# Altium project USBAudioAmp.PrjPCB
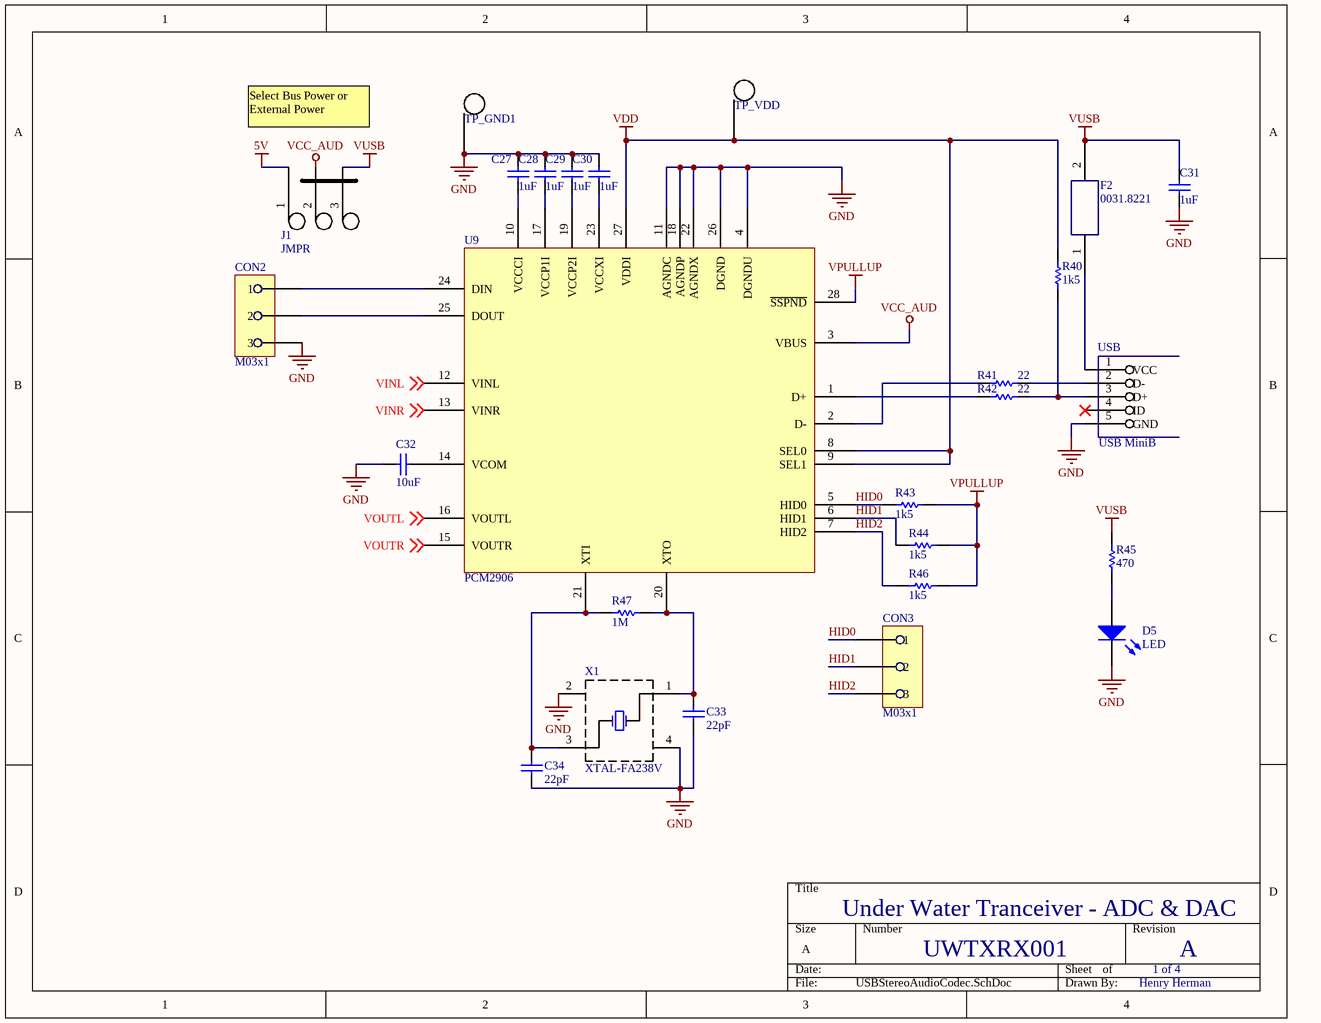
[diagram p0: USBStereoAudioCodec.SchDoc]
4 sheets, 125 parts. Net scope: global (net labels, ports and power ports of the same name join across sheets).
Board file: USBAudioAmp.PcbDoc
Sheets:
  USBStereoAudioCodec.SchDoc
  AmplifierOutput.SchDoc
  AmplifierInput.SchDoc
  PWRSUPPLY.SchDoc

## Sheet USBStereoAudioCodec.SchDoc
size A

### Parts
C27  value 1uF  [SM/C_0805]  (hidden comment: CAP)
C28  value 1uF  [SM/C_0805]  (hidden comment: CAP)
C29  value 1uF  [SM/C_0805]  (hidden comment: CAP)
C30  value 1uF  [SM/C_0805]  (hidden comment: CAP)
C31  value 1uF  [SM/C_0805]  (hidden comment: CAP)
C32  value 10uF  [SM/C_0805]  (hidden comment: CAP)
C33  value 22pF  [SM/C_0805]  (hidden comment: CAP)
C34  value 22pF  [SM/C_0805]  (hidden comment: CAP)
CON2  M03x1  [M03x1]
CON3  M03x1  [M03x1]
D5  LED  [LED-0805]
F2  0031.8221  [SM/R_0805]
J1  JMPR  [M03x1-nolock]
R40  value 1k5  [SM/R_0805]  (hidden comment: Res)
R41  value 22  [SM/R_0805]  (hidden comment: Res)
R42  value 22  [SM/R_0805]  (hidden comment: Res)
R43  value 1k5  [SM/R_0805]  (hidden comment: Res)
R44  value 1k5  [SM/R_0805]  (hidden comment: Res)
R45  value 470  [SM/R_0805]  (hidden comment: Res)
R46  value 1k5  [SM/R_0805]  (hidden comment: Res)
R47  value 1M  [SM/R_0805]  (hidden comment: Res)
TP_GND1  TEST_PT  [TEST_PT_SMD]  (value not drawn)
TP_VDD  TEST_PT  [TEST_PT_SMD]  (value not drawn)
U9  PCM2906  [SSOP-28PIN-TI]
USB  USB MiniB  [USB-MINIB]
X1  XTAL-FA238V  [XTAL 12MHz SMD]

### Nets
5V: J1.1(P1)
GND: C27.1 C28.1 C29.1 C30.1 C31.2 C32.2 C33.1 C34.1 CON2.3 D5.2(K) TP_GND1.1(TP?) U9.4(DGNDU) U9.11(AGNDC) U9.18(AGNDP) U9.22(AGNDX) U9.26(DGND) USB.5(GND) X1.2 X1.4
VCC_AUD: J1.2(P2) U9.3(VBUS)
VDD: R40.1 TP_VDD.1(TP?) U9.8(SEL0) U9.9(SEL1) U9.27(VDDI)
VPULLUP: R43.2 R44.2 R46.2 U9.28(~{SSPND})
VUSB: C31.1 F2.2 J1.3 R45.1
HID0: CON3.1 R43.1 U9.5(HID0)
HID1: CON3.2 R44.1 U9.6(HID1)
HID2: CON3.3 R46.1 U9.7(HID2)
VINL: U9.12(VINL) ; off-sheet VINL
VINR: U9.13(VINR) ; off-sheet VINR
VOUTL: U9.16(VOUTL) ; off-sheet VOUTL
VOUTR: U9.15(VOUTR) ; off-sheet VOUTR
NetC27_2: C27.2 U9.10(VCCCI)
NetC28_2: C28.2 U9.17(VCCP1I)
NetC29_2: C29.2 U9.19(VCCP2I)
NetC30_2: C30.2 U9.23(VCCXI)
NetC32_1: C32.1 U9.14(VCOM)
NetC33_2: C33.2 R47.1 U9.20(XTO) X1.1
NetC34_2: C34.2 R47.2 U9.21(XTI) X1.3
NetCON2_1: CON2.1 U9.24(DIN)
NetCON2_2: CON2.2 U9.25(DOUT)
NetD5_1: D5.1(A) R45.2
NetF2_1: F2.1 USB.1(VCC)
NetR40_2: R40.2 R42.2 USB.3(D+)
NetR41_1: R41.1 U9.2(D-)
NetR41_2: R41.2 USB.2(D-)
NetR42_1: R42.1 U9.1(D+)

Not connected (* = marked no-connect by the designer): USB 4(ID)*

### Notes on the sheet
- Select Bus Power or External Power
- Under Water Tranceiver - ADC & DAC
- UWTXRX001
- 1 of 4
- A
- Henry Herman

### Library data of the parts
F2 = Ferrite Bead: Published: 8-Jun-2000; LatestRevisionDate: 17-Jan-2003; LatestRevisionNote: PCB Footprint 'BCY-W3/D4.7' replaced; DatasheetDocument: 1997; PackageDocument: Sep-1998; PackageReference: TO-92A; Publisher: Altium Limited; ComponentLink1Description: Manufacturer Link; ComponentLink1URL: http://www.fairchildsemi.com/; ComponentLink2Description: Datasheet; ComponentLink2URL: http://www.fairchildsemi.com/ds/2N%2F2N3904.pdf
J1 = JMPR-3: Jumper; Published: 8-Jun-2000; LatestRevisionDate: 17-Jan-2003; LatestRevisionNote: PCB Footprint 'BCY-W3/D4.7' replaced; DatasheetDocument: 1997; PackageDocument: Sep-1998; PackageReference: TO-92A; Publisher: Altium Limited; ComponentLink1Description: Manufacturer Link; ComponentLink1URL: http://www.fairchildsemi.com/; ComponentLink2Description: Datasheet; ComponentLink2URL: http://www.fairchildsemi.com/ds/2N%2F2N3904.pdf
R40-R47 = Res: Resistor; Published: 8-Jun-2000; LatestRevisionDate: 17-Jul-2002; LatestRevisionNote: Re-released for DXP Platform.; PackageReference: AXIAL-0.3; Publisher: Altium Limited
U9 = PCM2906C
USB = USB MiniB: NPN General Purpose Amplifier; Published: 8-Jun-2000; LatestRevisionDate: 17-Jan-2003; LatestRevisionNote: PCB Footprint 'BCY-W3/D4.7' replaced; DatasheetDocument: 1997; PackageDocument: Sep-1998; PackageReference: TO-92A; Publisher: Altium Limited; ComponentLink1Description: Manufacturer Link; ComponentLink1URL: http://www.fairchildsemi.com/; ComponentLink2Description: Datasheet; ComponentLink2URL: http://www.fairchildsemi.com/ds/2N%2F2N3904.pdf
C27-C34 = CAP
  C27-C31: Label: 1uF
  C32: Label: 10uF

## Sheet AmplifierOutput.SchDoc
size A
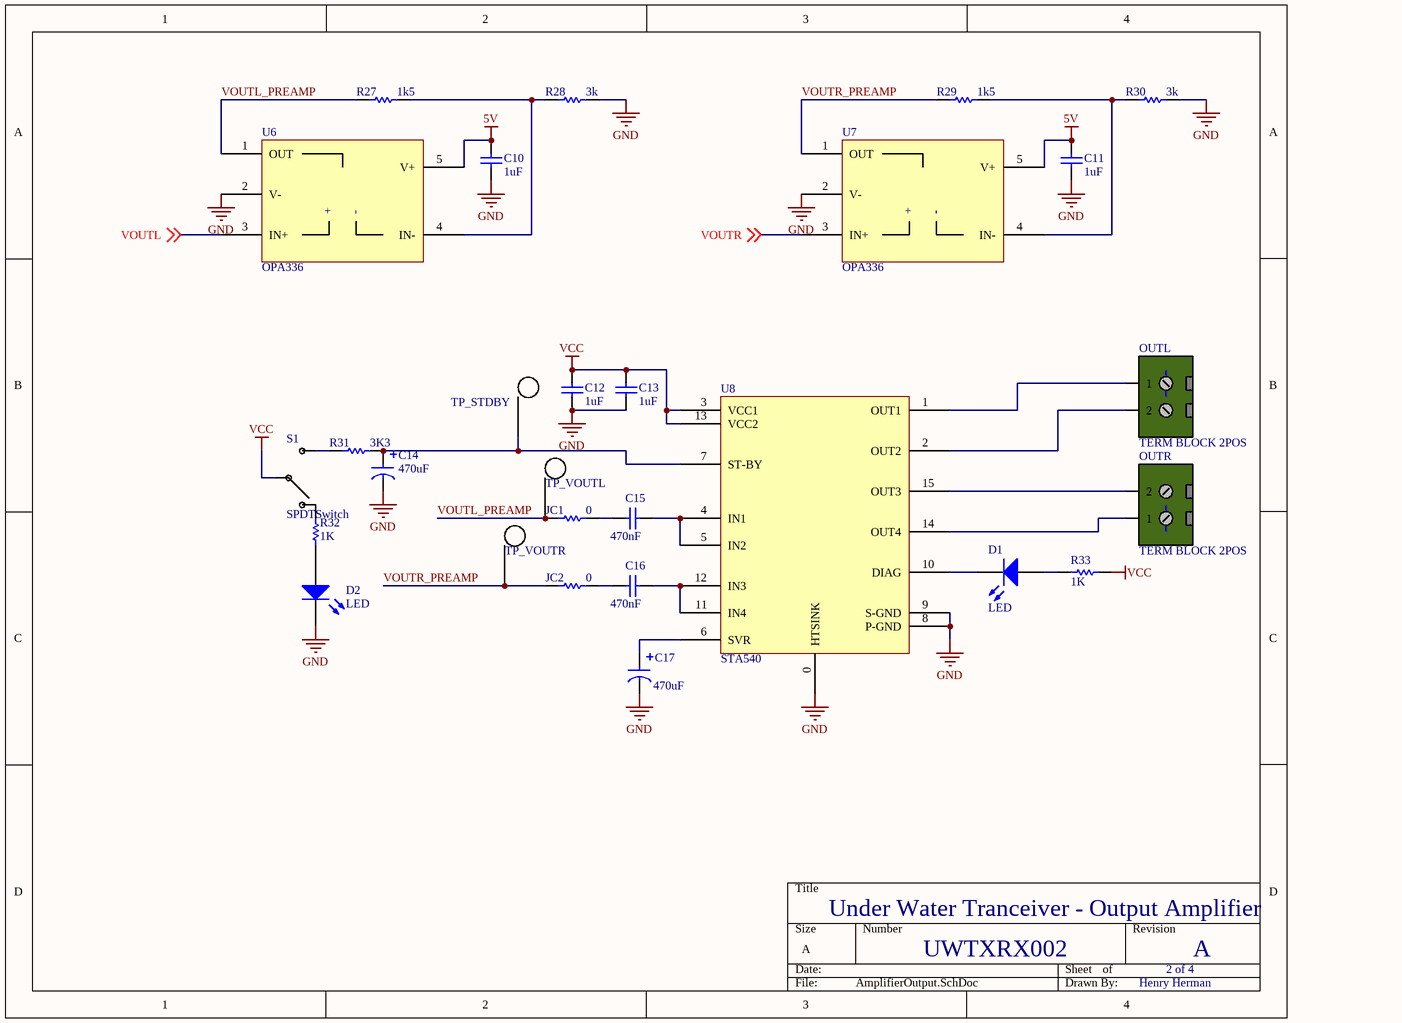
[diagram p1: AmplifierOutput.SchDoc]

### Parts
C10  value 1uF  [SM/C_0805]  (hidden comment: CAP)
C11  value 1uF  [SM/C_0805]  (hidden comment: CAP)
C12  value 1uF  [SM/C_0805]  (hidden comment: CAP)
C13  value 1uF  [SM/C_0805]  (hidden comment: CAP)
C14  value 470uF  [SM/CT_6032_12]  (hidden comment: CAP_POL)
C15  value 470nF  [SM/C_0805]  (hidden comment: CAP)
C16  value 470nF  [SM/C_0805]  (hidden comment: CAP)
C17  value 470uF  [SM/CT_6032_12]  (hidden comment: CAP_POL)
D1  LED  [LED-0805]
D2  LED  [LED-0805]
JC1  value 0  [SM/R_0805]  (hidden comment: Res)
JC2  value 0  [SM/R_0805]  (hidden comment: Res)
OUTL  TERM BLOCK 2POS  [Conn-ScrewTerminal-2pin-Phoenix]
OUTR  TERM BLOCK 2POS  [Conn-ScrewTerminal-2pin-Phoenix]
R27  value 1k5  [SM/R_0805]  (hidden comment: Res)
R28  value 3k  [SM/R_0805]  (hidden comment: Res)
R29  value 1k5  [SM/R_0805]  (hidden comment: Res)
R30  value 3k  [SM/R_0805]  (hidden comment: Res)
R31  value 3K3  [SM/R_0805]  (hidden comment: Res)
R32  value 1K  [SM/R_0805]  (hidden comment: Res)
R33  value 1K  [SM/R_0805]  (hidden comment: Res)
S1  SPDTSwitch  [SPDTSwitch]
TP_STDBY  TEST_PT  [TEST_PT_SMD]  (value not drawn)
TP_VOUTL  TEST_PT  [TEST_PT_SMD]  (value not drawn)
TP_VOUTR  TEST_PT  [TEST_PT_SMD]  (value not drawn)
U6  OPA336  [SOT23-5 -TI]
U7  OPA336  [SOT23-5 -TI]
U8  STA540  [STA540_Multiwatt15]

### Nets
5V: C10.1 C11.1 U6.5(V+) U7.5(V+)
GND: C10.2 C11.2 C12.1 C13.1 C14.2 C17.2 D2.2(K) R28.2 R30.2 U6.2(V-) U7.2(V-) U8.0(HTSINK) U8.8(P-GND) U8.9(S-GND)
VCC: C12.2 C13.2 R33.1 S1.2(C) U8.3(VCC1) U8.13(VCC2)
VOUTL: U6.3(IN+) ; off-sheet VOUTL
VOUTL_PREAMP: JC1.1 R27.1 TP_VOUTL.1(TP?) U6.1(OUT)
VOUTR: U7.3(IN+) ; off-sheet VOUTR
VOUTR_PREAMP: JC2.1 R29.1 TP_VOUTR.1(TP?) U7.1(OUT)
NetC14_1: C14.1 R31.2 TP_STDBY.1(TP?) U8.7(ST-BY)
NetC15_1: C15.1 JC1.2
NetC15_2: C15.2 U8.4(IN1) U8.5(IN2)
NetC16_1: C16.1 JC2.2
NetC16_2: C16.2 U8.11(IN4) U8.12(IN3)
NetC17_1: C17.1 U8.6(SVR)
NetD1_1: D1.1(A) R33.2
NetD1_2: D1.2(K) U8.10(DIAG)
NetD2_1: D2.1(A) R32.2
NetOUTL_1: OUTL.1 U8.1(OUT1)
NetOUTL_2: OUTL.2 U8.2(OUT2)
NetOUTR_1: OUTR.1 U8.14(OUT4)
NetOUTR_2: OUTR.2 U8.15(OUT3)
NetR27_2: R27.2 R28.1 U6.4(IN-)
NetR29_2: R29.2 R30.1 U7.4(IN-)
NetR31_1: R31.1 S1.3(P2)
NetR32_1: R32.1 S1.1(P1)

### Notes on the sheet
- Under Water Tranceiver - Output Amplifier
- UWTXRX002
- 2 of 4
- A
- Henry Herman
- (in symbol OPA335) +; -

### Library data of the parts
C14 C17 = CAP_POL: CAP
JC1 JC2 R27-R33 = Res: Resistor; Published: 8-Jun-2000; LatestRevisionDate: 17-Jul-2002; LatestRevisionNote: Re-released for DXP Platform.; PackageReference: AXIAL-0.3; Publisher: Altium Limited
OUTL OUTR = 2Pin-PhoenixTerminalBlock
U6 U7 = OPA335

## Sheet AmplifierInput.SchDoc
size B
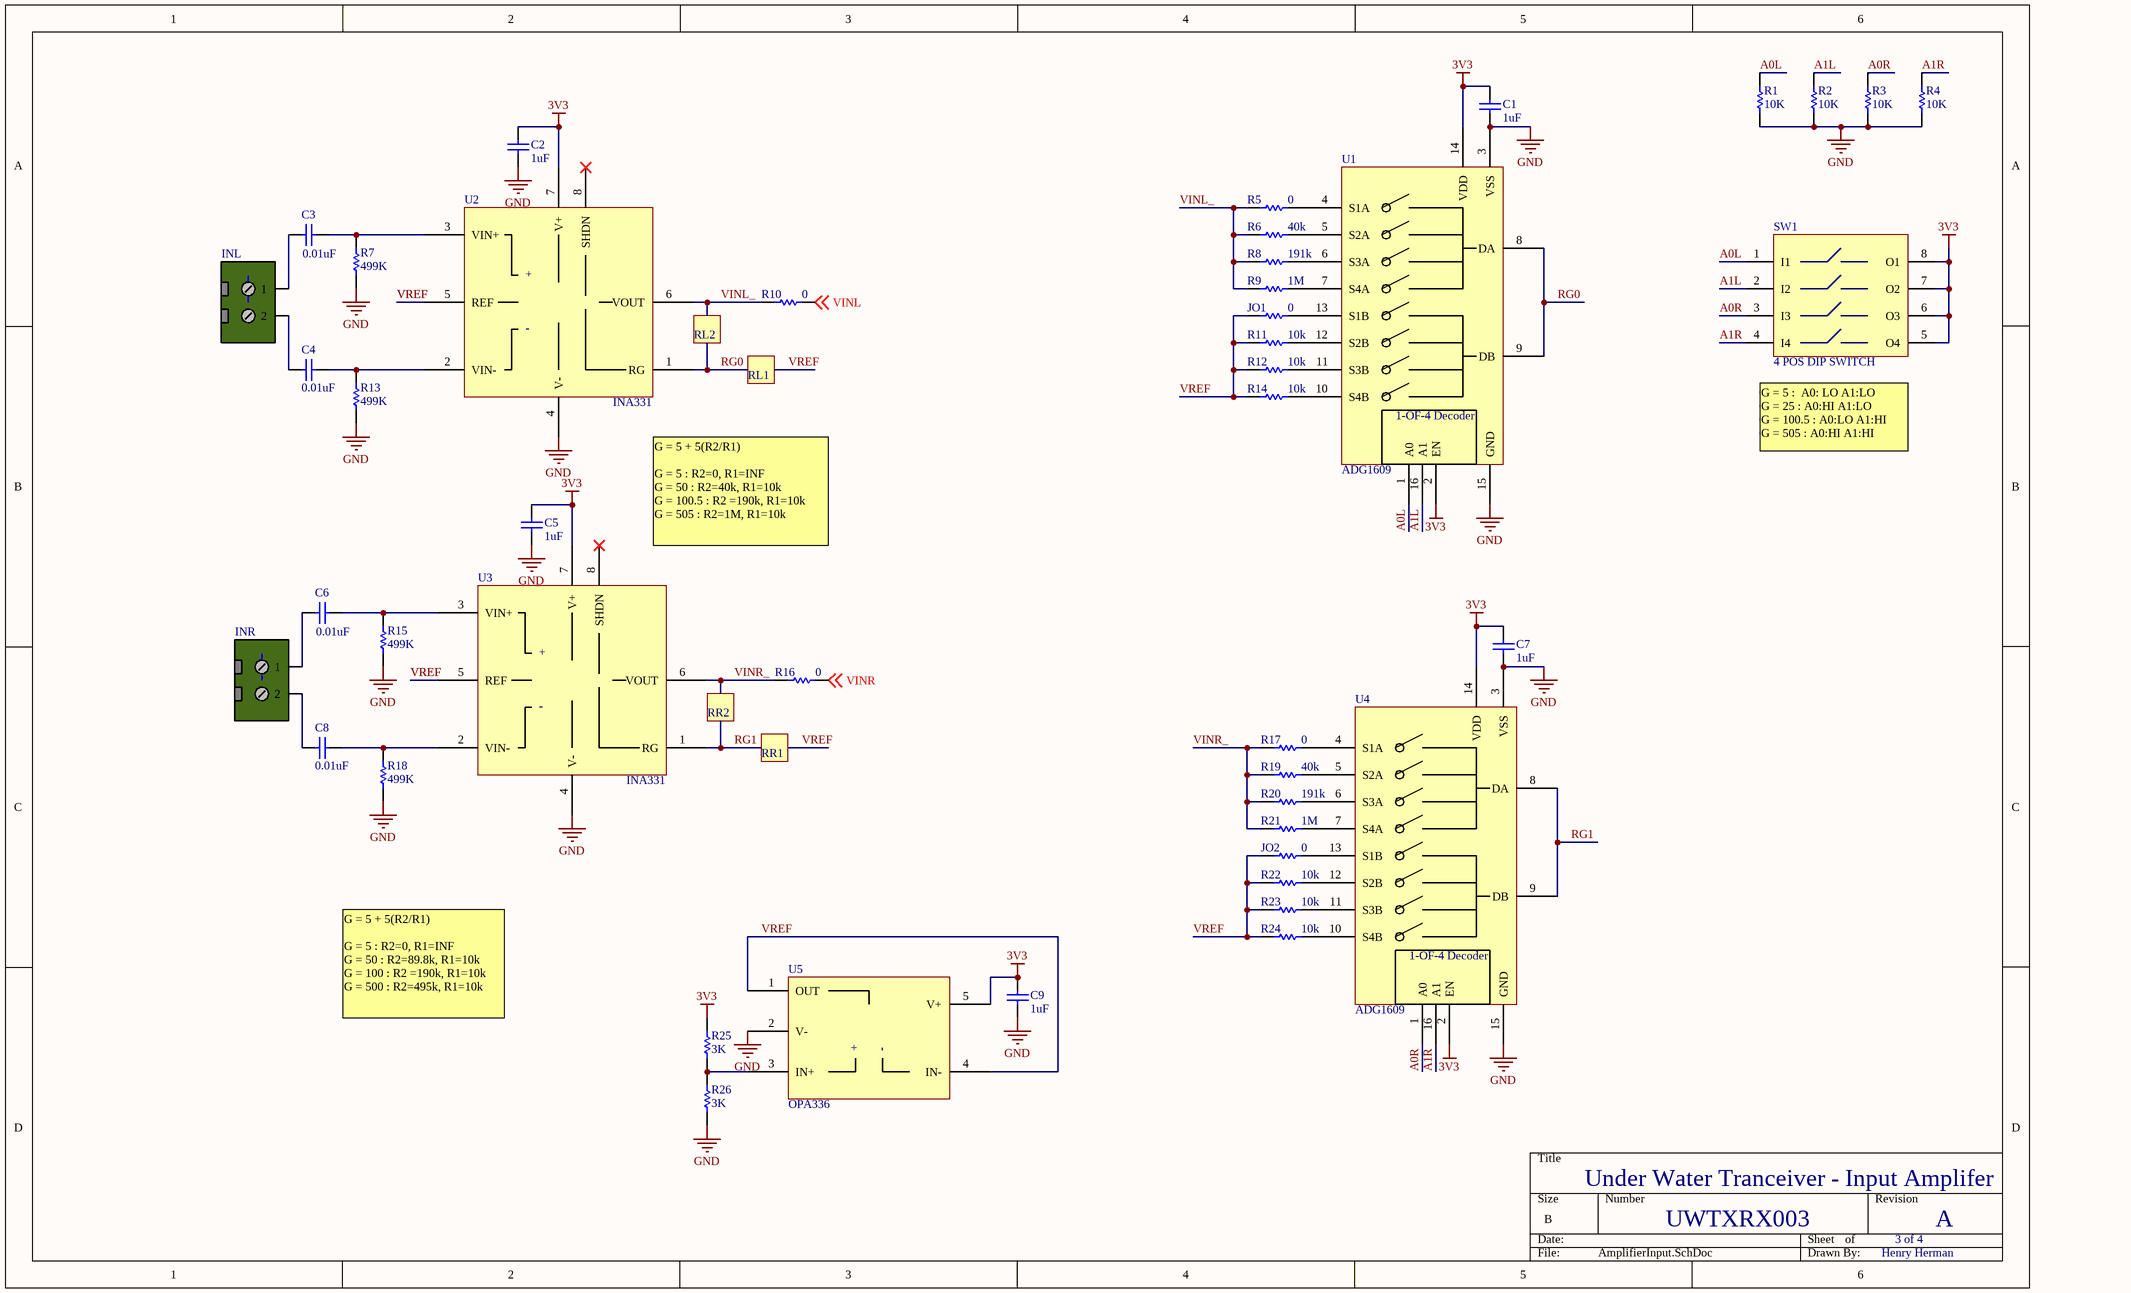
[diagram p2: AmplifierInput.SchDoc]

### Parts
C1  value 1uF  [SM/C_0805]  (hidden comment: CAP)
C2  value 1uF  [SM/C_0805]  (hidden comment: CAP)
C3  value 0.01uF  [SM/C_0805]  (hidden comment: CAP)
C4  value 0.01uF  [SM/C_0805]  (hidden comment: CAP)
C5  value 1uF  [SM/C_0805]  (hidden comment: CAP)
C6  value 0.01uF  [SM/C_0805]  (hidden comment: CAP)
C7  value 1uF  [SM/C_0805]  (hidden comment: CAP)
C8  value 0.01uF  [SM/C_0805]  (hidden comment: CAP)
C9  value 1uF  [SM/C_0805]  (hidden comment: CAP)
INL  TERM BLOCK 2POS  [Conn-ScrewTerminal-2pin-Phoenix]  (value not drawn)
INR  TERM BLOCK 2POS  [Conn-ScrewTerminal-2pin-Phoenix]  (value not drawn)
JO1  value 0  [SM/R_0805]  (hidden comment: Res)
JO2  value 0  [SM/R_0805]  (hidden comment: Res)
R1  value 10K  [SM/R_0805]  (hidden comment: Res)
R2  value 10K  [SM/R_0805]  (hidden comment: Res)
R3  value 10K  [SM/R_0805]  (hidden comment: Res)
R4  value 10K  [SM/R_0805]  (hidden comment: Res)
R5  value 0  [SM/R_0805]  (hidden comment: Res)
R6  value 40k  [SM/R_0805]  (hidden comment: Res)
R7  value 499K  [SM/R_0805]  (hidden comment: Res)
R8  value 191k  [SM/R_0805]  (hidden comment: Res)
R9  value 1M  [SM/R_0805]  (hidden comment: Res)
R10  value 0  [SM/R_0805]  (hidden comment: Res)
R11  value 10k  [SM/R_0805]  (hidden comment: Res)
R12  value 10k  [SM/R_0805]  (hidden comment: Res)
R13  value 499K  [SM/R_0805]  (hidden comment: Res)
R14  value 10k  [SM/R_0805]  (hidden comment: Res)
R15  value 499K  [SM/R_0805]  (hidden comment: Res)
R16  value 0  [SM/R_0805]  (hidden comment: Res)
R17  value 0  [SM/R_0805]  (hidden comment: Res)
R18  value 499K  [SM/R_0805]  (hidden comment: Res)
R19  value 40k  [SM/R_0805]  (hidden comment: Res)
R20  value 191k  [SM/R_0805]  (hidden comment: Res)
R21  value 1M  [SM/R_0805]  (hidden comment: Res)
R22  value 10k  [SM/R_0805]  (hidden comment: Res)
R23  value 10k  [SM/R_0805]  (hidden comment: Res)
R24  value 10k  [SM/R_0805]  (hidden comment: Res)
R25  value 3K  [SM/R_0805]  (hidden comment: Res)
R26  value 3K  [SM/R_0805]  (hidden comment: Res)
SW1  4 POS DIP SWITCH  [DIPSW4PIN]
U1  ADG1609  [TSSOP 16LEAD - Analog Devices - ADG1609]
U2  INA331  [MSOP-8PIN-TI]
U3  INA331  [MSOP-8PIN-TI]
U4  ADG1609  [TSSOP 16LEAD - Analog Devices - ADG1609]
U5  OPA336  [SOT23-5 -TI]

### Nets
3V3: C1.1 C2.1 C5.1 C7.1 C9.1 R25.1 SW1.5(O4) SW1.6(O3) SW1.7(O2) SW1.8(O1) U1.2(EN) U1.14(VDD) U2.7(V+) U3.7(V+) U4.2(EN) U4.14(VDD) U5.5(V+)
GND: C1.2 C2.2 C5.2 C7.2 C9.2 R1.1 R2.1 R3.1 R4.1 R7.2 R13.2 R15.2 R18.2 R26.2 U1.3(VSS) U1.15(GND) U2.4(V-) U3.4(V-) U4.3(VSS) U4.15(GND) U5.2(V-)
A0L: R1.2 SW1.1(I1) U1.1(A0)
A0R: R3.2 SW1.3(I3) U4.1(A0)
A1L: R2.2 SW1.2(I2) U1.16(A1)
A1R: R4.2 SW1.4(I4) U4.16(A1)
RG0: U1.8(DA) U1.9(DB) U2.1(RG)
RG1: U3.1(RG) U4.8(DA) U4.9(DB)
VINL: R10.1 ; off-sheet VINL
VINL_: R5.2 R6.2 R8.2 R9.2 R10.2 U2.6(VOUT)
VINR: R16.1 ; off-sheet VINR
VINR_: R16.2 R17.2 R19.2 R20.2 R21.2 U3.6(VOUT)
VREF: JO1.2 JO2.2 R11.2 R12.2 R14.2 R22.2 R23.2 R24.2 U2.5(REF) U3.5(REF) U5.1(OUT) U5.4(IN-)
NetC3_1: C3.1 R7.1 U2.3(VIN+)
NetC3_2: C3.2 INL.1
NetC4_1: C4.1 R13.1 U2.2(VIN-)
NetC4_2: C4.2 INL.2
NetC6_1: C6.1 R15.1 U3.3(VIN+)
NetC6_2: C6.2 INR.1
NetC8_1: C8.1 R18.1 U3.2(VIN-)
NetC8_2: C8.2 INR.2
NetJO1_1: JO1.1 U1.13(S1B)
NetJO2_1: JO2.1 U4.13(S1B)
NetR5_1: R5.1 U1.4(S1A)
NetR6_1: R6.1 U1.5(S2A)
NetR8_1: R8.1 U1.6(S3A)
NetR9_1: R9.1 U1.7(S4A)
NetR11_1: R11.1 U1.12(S2B)
NetR12_1: R12.1 U1.11(S3B)
NetR14_1: R14.1 U1.10(S4B)
NetR17_1: R17.1 U4.4(S1A)
NetR19_1: R19.1 U4.5(S2A)
NetR20_1: R20.1 U4.6(S3A)
NetR21_1: R21.1 U4.7(S4A)
NetR22_1: R22.1 U4.12(S2B)
NetR23_1: R23.1 U4.11(S3B)
NetR24_1: R24.1 U4.10(S4B)
NetR25_2: R25.2 R26.1 U5.3(IN+)

Not connected (* = marked no-connect by the designer): U2 8(SHDN)*; U3 8(SHDN)*

### Notes on the sheet
- (near U2) RL2
- RL1
- (near SW1) G = 5 :  A0: LO A1:LO
  G = 25 : A0:HI A1:LO
  G = 100.5 : A0:LO A1:HI
  G = 505 : A0:HI A1:HI
- G = 5 + 5(R2/R1)
  G = 5 : R2=0, R1=INF
  G = 50 : R2=40k, R1=10k
  G = 100.5 : R2 =190k, R1=10k
  G = 505 : R2=1M, R1=10k
- (near U3) RR2
- RR1
- G = 5 + 5(R2/R1)
  G = 5 : R2=0, R1=INF
  G = 50 : R2=89.8k, R1=10k
  G = 100 : R2 =190k, R1=10k
  G = 500 : R2=495k, R1=10k
- Under Water Tranceiver - Input Amplifer
- UWTXRX003
- 3 of 4
- A
- Henry Herman
- (in symbol ADG1609) 1-OF-4 Decoder
- (in symbol INA331) +; -
- (in symbol OPA335) +; -

### Library data of the parts
INL INR = 2Pin-PhoenixTerminalBlock
JO1 JO2 R1-R26 = Res: Resistor; Published: 8-Jun-2000; LatestRevisionDate: 17-Jul-2002; LatestRevisionNote: Re-released for DXP Platform.; PackageReference: AXIAL-0.3; Publisher: Altium Limited
U5 = OPA335

## Sheet PWRSUPPLY.SchDoc
size A
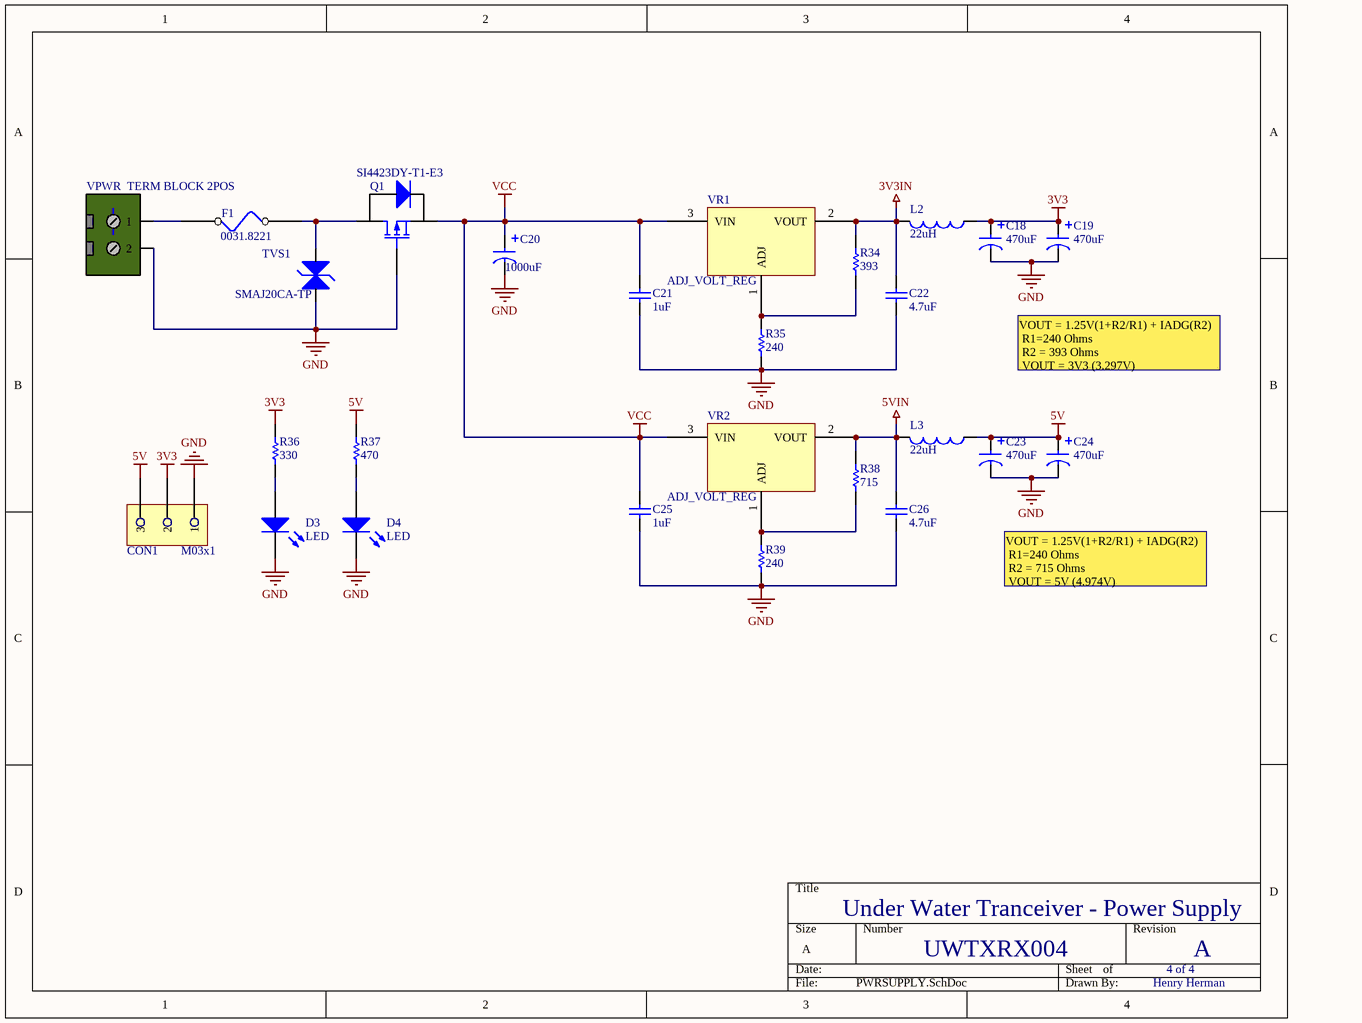
[diagram p3: PWRSUPPLY.SchDoc]

### Parts
C18  value 470uF  [SM/CT_6032_12]  (hidden comment: CAP_POL)
C19  value 470uF  [SM/CT_6032_12]  (hidden comment: CAP_POL)
C20  value 1000uF  [CAP-CAN-SMD-POL-12.5mmDia]  (hidden comment: CAP_POL)
C21  value 1uF  [SM/C_0805]  (hidden comment: CAP)
C22  value 4.7uF  [SM/C_0805]  (hidden comment: CAP)
C23  value 470uF  [SM/CT_6032_12]  (hidden comment: CAP_POL)
C24  value 470uF  [SM/CT_6032_12]  (hidden comment: CAP_POL)
C25  value 1uF  [SM/C_0805]  (hidden comment: CAP)
C26  value 4.7uF  [SM/C_0805]  (hidden comment: CAP)
CON1  M03x1  [M03x1]
D3  LED  [LED-0805]
D4  LED  [LED-0805]
F1  0031.8221  [SCHURTER/SMD/2 PADS/0031.8221]
L2  22uH  [G_JMETRIC/TDK/SLE10145]
L3  22uH  [G_JMETRIC/TDK/SLE10145]
Q1  SI4423DY-T1-E3  [SOIC-8-Lead-Vishay-PFET]
R34  value 393  [SM/R_0805]  (hidden comment: Res)
R35  value 240  [SM/R_0805]  (hidden comment: Res)
R36  value 330  [SM/R_0805]  (hidden comment: Res)
R37  value 470  [SM/R_0805]  (hidden comment: Res)
R38  value 715  [SM/R_0805]  (hidden comment: Res)
R39  value 240  [SM/R_0805]  (hidden comment: Res)
TVS1  SMAJ20CA-TP  [D0-214AC]
VPWR  TERM BLOCK 2POS  [Conn-ScrewTerminal-2pin-Phoenix]
VR1  ADJ_VOLT_REG  [LM317-SOT233-POS-ADJ-VOLT_REG]
VR2  ADJ_VOLT_REG  [LM317-SOT233-POS-ADJ-VOLT_REG]

### Nets
3V3: C18.1 C19.1 CON1.2 L2.1 R36.1
3V3IN: C22.2 L2.2 R34.2 VR1.2(VOUT)
5V: C23.1 C24.1 CON1.3 L3.1 R37.1
5VIN: C26.2 L3.2 R38.1 VR2.2(VOUT)
GND: C18.2 C19.2 C20.2 C21.1 C22.1 C23.2 C24.2 C25.1 C26.1 CON1.1 D3.2(K) D4.2(K) Q1.G R35.1 R39.1 TVS1.C VPWR.2
VCC: C20.1 C21.2 C25.2 Q1.S VR1.3(VIN) VR2.3(VIN)
NetD3_1: D3.1(A) R36.2
NetD4_1: D4.1(A) R37.2
NetF1_1: F1.1 VPWR.1
NetF1_2: F1.2 Q1.D TVS1.A
NetR34_1: R34.1 R35.2 VR1.1(ADJ)
NetR38_2: R38.2 R39.2 VR2.1(ADJ)

### Notes on the sheet
- VOUT = 1.25V(1+R2/R1) + IADG(R2)
  R1=240 Ohms
  R2 = 393 Ohms
  VOUT = 3V3 (3.297V)
- VOUT = 1.25V(1+R2/R1) + IADG(R2)
  R1=240 Ohms
  R2 = 715 Ohms
  VOUT = 5V (4.974V)
- Under Water Tranceiver - Power Supply
- UWTXRX004
- 4 of 4
- A
- Henry Herman

### Library data of the parts
C18-C20 C23 C24 = CAP_POL: CAP
F1 = 2105: FUSEHOLDER BLACK FOR SMD 5X20MM; mfrName: Schurter Inc; Extra_Description: Standard Package == 100 / Category == Circuit Protection / Family == Fuseholders / Series == OGN / Type == Holder / Fuse Size == 5mm x 20mm / Number of Circuits == 1 / Mounting Type == Surface Mount / Termination Style == Surface Mount (SMD,SMT) / Voltage == 500V / Current Rating == 10A / Material == Copper Alloy, Tin Plated / Catalog Page == 2139 (US2010 Interactive) / Other Names == 0031.8221-ND486-1260; Obsolete: False; Temp_Max: 0; Type: Fuseholders; TypeNotes: Added 12/11/2010 2:44:25 PM; PartID: 2105; mfrPartNum: 0031.8221; URL_Image: HTTP://MEDIA.DIGIKEY.COM/PHOTOS/SCHURTER%20PHOTOS/0031.8221.JPG; URL_Datasheet: http://www.schurterinc.com/var/schurter/storage/ilcatalogue/files/document/datasheet/en/pdf/typ_OGN-SMD.pdf; Date_Created: 12/11/2010 2:47:02 PM; Date_LastModified: 12/11/2010 2:47:02 PM; Verified: False; RoHS: True; Temp_Min: 0
L2 L3 = 1660: INDUCTOR SHIELD PWR 22UH 10145; mfrName: TDK Corporation; mfrPartNum: SLF10145T-220M1R9-PF; Extra_Description: TDK Corporation / Inductance22µH / Tolerance±20% / SeriesSLF / Package / Case10.1mm x 10.1mm x 4.5mm / PackagingCut Tape (CT) / TypeFerrite Core / Current1.9A / Lead Free StatusLead Free / RoHS StatusRoHS Compliant / Other Names445-1981-1; Type: Fixed; PartID: 1660; URL_Datasheet: http://www.digikey.com/scripts/DkSearch/dksus.dll?Pname?Name=445-1981-1-ND&Site=US; Date_Created: 4/21/2006 2:20:33 PM; Date_LastModified: 8/21/2009 1:12:56 AM; Verified: False
Q1 = 2390: mosfet,p ch,20v,10a,8soic; transistor polarity:p channel;; mfrName: Vishay; Extra_Description: MOSFET,P CH,20V,10A,8SOIC; Transistor Polarity:P Channel; Drain Source Voltage Vds:-20V; On Resistance Rds(on):6mohm; Rds(on) Test Voltage Vgs:-4.5V; Operating Temperature Range:-55°C to +150°C; Transistor Case Style:SOIC; No. of Pins:8; SVHC:No SVHC (15-Dec-2010); Current Id Max:-10A; Power Dissipation Pd:1.5W; Voltage Vgs Max:-8V / Polarity: ``P-Channel`` / Case / Package: ``SO-8`` / Packaging: ``Reel`` / Lead-Free Status: ``Lead Free`` / RoHS: ``Compliant`` / Id [Continuous Drain Current]: { / ``uncertainty_minus``: null, / ``value``: -14.0, / ``uncertainty_plus``: null / } / Rds [Drain to Source Resistance] (on): { / ``uncertainty_minus``: null, / ``value``: 0.0075, / ``uncertainty_plus``: null / } / Vds [Drain to Source Voltage]: { / ``uncertainty_minus``: null, / ``value``: -20.0, / ``uncertainty_plus``: null / } / Power Dissipation: { / ``uncertainty_minus``: null, / ``value``: 1.5, / ``uncertainty_plus``: null / } / Breakdown Voltage [Gate to Source]: { / ``max_value``: 8.0, / ``max_uncertainty_plus``: null, / ``min_value``: -8.0, / ``min_uncertainty_plus``: null, / ``max_uncertainty_minus``: null / } / Number of Pins: 8; Obsolete: False; Temp_Max: 0; Type: All Parts; TypeNotes: Applies to all parts in the database; PartID: 2390; mfrPartNum: SI4423DY-T1-E3; URL_Image: http://cdn.sigma.octopart.com/9542269/image/Vishay-SI4423DY-T1-E3.jpg; URL_Datasheet: http://datasheet.octopart.com/SI4423DY-T1-E3-Vishay-datasheet-8542980.pdf; Date_Created: 8/20/2011 8:24:30 AM; Date_LastModified: 8/20/2011 8:24:30 AM; Verified: False; RoHS: True; Temp_Min: 0
R34-R39 = Res: Resistor; Published: 8-Jun-2000; LatestRevisionDate: 17-Jul-2002; LatestRevisionNote: Re-released for DXP Platform.; PackageReference: AXIAL-0.3; Publisher: Altium Limited
TVS1 = 2519: TVS 400W 12V BIDIRECT SMA; mfrName: Micro Commercial Co.; mfrPartNum: SMAJ12CA-TP; Extra_Description: Datasheets	SMAJ5.0 thru SMAJ440CA / Product Photos	SMA, DO-214AC BIDIRECT / Product Training Modules	Transient Voltage Suppressors / Diode Handling and Mounting / Catalog Drawings	SMA Series Top / Featured Product	Surface Mount TVS / Standard Package	1 / Category	Circuit Protection / Family	TVS - Diodes / Series	- / Voltage - Reverse Standoff (Typ)	12V / Voltage - Breakdown	13.3V / Power (Watts)	400W / Polarization	Bidirectional / Mounting Type	Surface Mount / Package / Case	DO-214AC, SMA / Supplier Device Package	SMA / Packaging	Cut Tape (CT) / Other Names	SMAJ12CA-TPMSCT; Obsolete: False; Temp_Max: 0; TypeNotes: Applies to all parts in the database; PartID: 2519; URL_Image: http://media.digikey.com/photos/Micro%20Commercial%20Photos/SMAJ8.5CA-TP.JPG; URL_Datasheet: http://61.222.192.61/mccsemi/up_pdf/SMAJ5.0~SMAJ440CA(SMA).pdf; Date_Created: 2/24/2012 10:06:52 PM; Date_LastModified: 2/24/2012 10:06:52 PM; Verified: False; RoHS: True; Temp_Min: 0; Type: All Parts
VPWR = 2Pin-PhoenixTerminalBlock

## Nets that join several sheets
3V3: AmplifierInput (17 pins), PWRSUPPLY (5 pins)
5V: USBStereoAudioCodec (J1.1), AmplifierOutput (C10.1 C11.1 U6.5 U7.5), PWRSUPPLY (5 pins)
GND: USBStereoAudioCodec (19 pins), AmplifierOutput (14 pins), AmplifierInput (21 pins), PWRSUPPLY (17 pins)
VCC: AmplifierOutput (6 pins), PWRSUPPLY (6 pins)
VINL: USBStereoAudioCodec (U9.12), AmplifierInput (R10.1)
VINR: USBStereoAudioCodec (U9.13), AmplifierInput (R16.1)
VOUTL: USBStereoAudioCodec (U9.16), AmplifierOutput (U6.3)
VOUTR: USBStereoAudioCodec (U9.15), AmplifierOutput (U7.3)